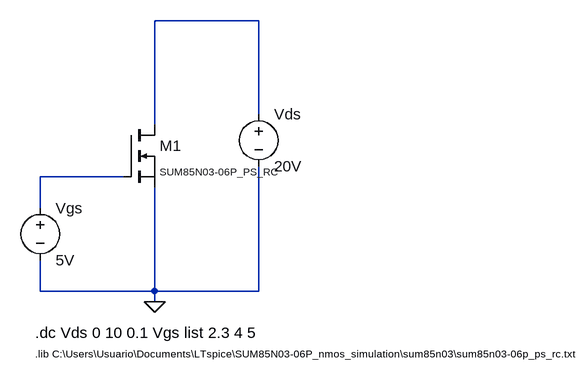
[diagram p0: schematic SUM85N03-06P.asc]
SUM85N03-06P.asc, the LTspice schematic file:
Version 4.1
SHEET 1 1368 680
WIRE 384 -64 224 -64
WIRE 384 80 384 -64
WIRE 224 96 224 -64
WIRE 176 176 48 176
WIRE 48 224 48 176
WIRE 48 352 48 304
WIRE 224 352 224 192
WIRE 224 352 48 352
WIRE 384 352 384 160
WIRE 384 352 224 352
WIRE 224 368 224 352
FLAG 224 368 0
SYMBOL nmos 176 96 R0
WINDOW 3 56 72 Left 1
SYMATTR InstName M1
SYMATTR Value SUM85N03-06P_PS_RC
SYMATTR Prefix X
SYMBOL voltage 48 208 R0
SYMATTR InstName Vgs
SYMATTR Value 5V
SYMBOL voltage 384 64 R0
SYMATTR InstName Vds
SYMATTR Value 20V
TEXT 40 416 Left 2 !.dc Vds 0 10 0.1 Vgs list 2.3 4 5
TEXT 40 448 Left 1 !.lib C:\\Users\\Usuario\\Documents\\LTspice\\SUM85N03-06P_nmos_simulation\\sum85n03\\sum85n03-06p_ps_rc.txt

The netlist it stands for:
* SUM85N03-06P.asc
X§M1 N001 N002 0 SUM85N03-06P_PS_RC  ; pins D G S
Vgs N002 0 5V
Vds N001 0 20V
.dc Vds 0 10 0.1 Vgs list 2.3 4 5
.lib C:\Users\Usuario\Documents\LTspice\SUM85N03-06P_nmos_simulation\sum85n03\sum85n03-06p_ps_rc.txt
.backanno
.end